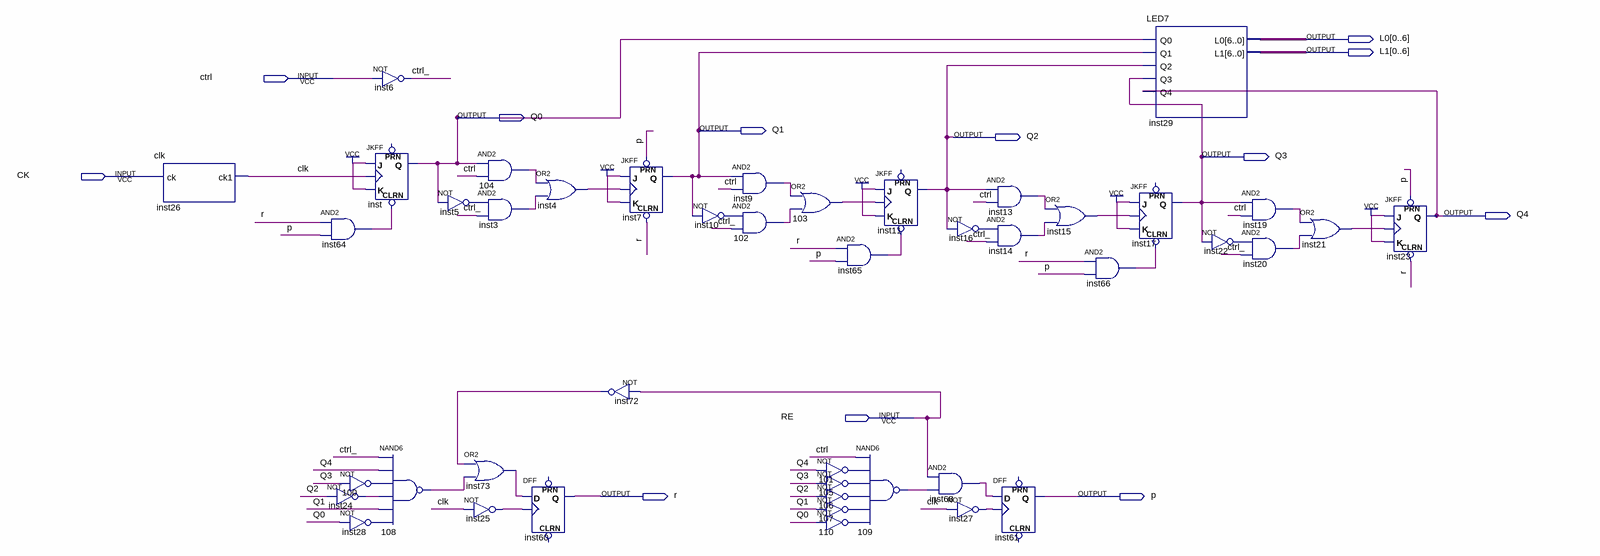
[diagram p0: schematic sheet]
// Quartus schematic work5_1.bdf as structural Verilog: 44 symbols, 12 pins
module work5_1 (
  input  ctrl,
  input  CK,
  input  RE,
  output [0:6] L0,
  output [0:6] L1,
  output Q0,
  output Q1,
  output Q2,
  output Q3,
  output Q4,
  output r,
  output p
);

  wire clk, ctrl_, inst3_out, inst4_out, inst5_out, inst9_out, inst10_out, inst13_out, inst14_out,
       inst15_out, inst16_out, inst19_out, inst20_out, inst21_out, inst22_out, inst24_out, inst25_out,
       inst27_out, inst28_out, inst64_out, inst65_out, inst66_out, inst68_out, inst72_out, inst73_out,
       n100_out, n101_out, n102_out, n103_out, n104_out, n105_out, n106_out, n107_out, n108_out, n109_out,
       n110_out;

  clk inst26 (.ck(CK), .ck1(clk));
  and inst64 (inst64_out, r, p);
  not u_100 (n100_out, Q3);
  not inst24 (inst24_out, Q2);
  not inst28 (inst28_out, Q0);
  not inst6 (ctrl_, ctrl);
  JKFF inst (.CLRN(inst64_out), .K(1'b1), .J(1'b1), .CLK(clk), .Q(Q0));  // open: PRN
  nand u_108 (n108_out, ctrl_, Q4, n100_out, inst24_out, Q1, inst28_out);
  not inst5 (inst5_out, Q0);
  or inst73 (inst73_out, inst72_out, n108_out);
  not inst25 (inst25_out, clk);
  and u_104 (n104_out, Q0, ctrl);
  and inst3 (inst3_out, inst5_out, ctrl_);
  or inst4 (inst4_out, n104_out, inst3_out);
  DFF inst60 (.CLK(inst25_out), .D(inst73_out), .Q(r));  // open: CLRN, PRN
  JKFF inst7 (.PRN(p), .CLRN(r), .K(1'b1), .J(1'b1), .CLK(inst4_out), .Q(Q1));
  not inst72 (inst72_out, RE);
  not inst10 (inst10_out, Q1);
  and inst9 (inst9_out, Q1, ctrl);
  and u_102 (n102_out, inst10_out, ctrl_);
  or u_103 (n103_out, inst9_out, n102_out);
  not u_101 (n101_out, Q4);
  not u_105 (n105_out, Q3);
  not u_106 (n106_out, Q2);
  not u_107 (n107_out, Q1);
  not u_110 (n110_out, Q0);
  JKFF inst11 (.CLRN(inst65_out), .K(1'b1), .J(1'b1), .CLK(n103_out), .Q(Q2));  // open: PRN
  and inst65 (inst65_out, r, p);
  nand u_109 (n109_out, ctrl, n101_out, n105_out, n106_out, n107_out, n110_out);
  and inst68 (inst68_out, RE, n109_out);
  and inst13 (inst13_out, Q2, ctrl);
  and inst14 (inst14_out, inst16_out, ctrl_);
  not inst16 (inst16_out, Q2);
  not inst27 (inst27_out, clk);
  DFF inst61 (.CLK(inst27_out), .D(inst68_out), .Q(p));  // open: CLRN, PRN
  or inst15 (inst15_out, inst13_out, inst14_out);
  and inst66 (inst66_out, r, p);
  LED7 inst29 (.Q0(Q0), .Q1(Q1), .Q2(Q2), .Q3(Q3), .Q4(Q4), .L0(L0), .L1(L1));
  JKFF inst17 (.CLRN(inst66_out), .K(1'b1), .J(1'b1), .CLK(inst15_out), .Q(Q3));  // open: PRN
  and inst19 (inst19_out, Q3, ctrl);
  and inst20 (inst20_out, inst22_out, ctrl_);
  not inst22 (inst22_out, Q3);
  or inst21 (inst21_out, inst19_out, inst20_out);
  JKFF inst23 (.PRN(p), .CLRN(r), .K(1'b1), .J(1'b1), .CLK(inst21_out), .Q(Q4));
endmodule
